# EAGLE design X2FA (EAGLE 9.7.0)
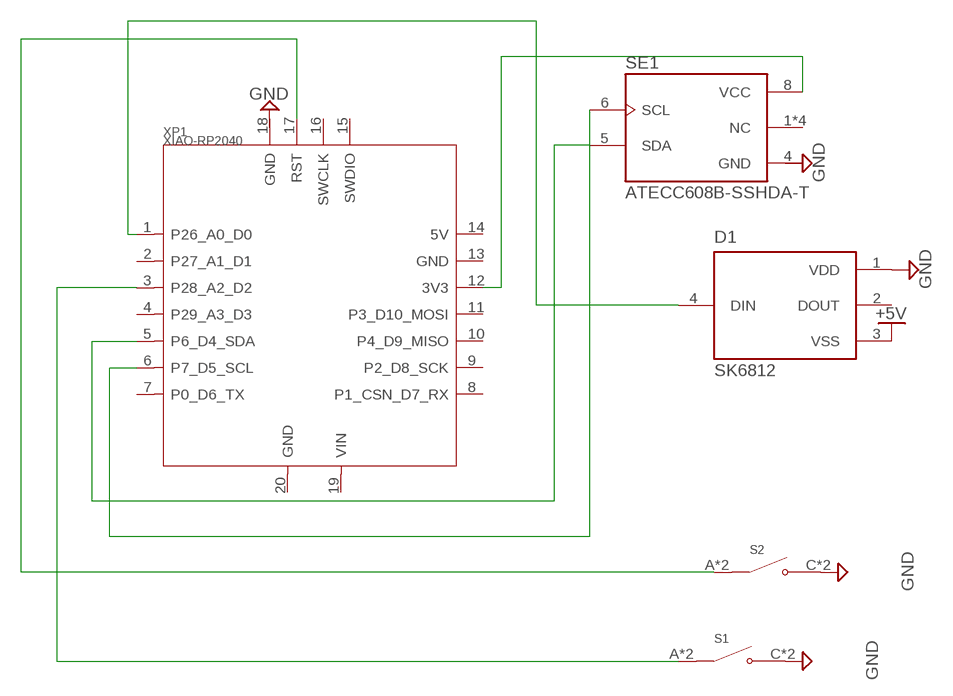
[diagram p0: schematic, sheet 1]

## Parts
D1  SK6812  [LED_SK6812]
S1  TS-1187A-B-A-B  [SW_TS-1187A-B-A-B]
S2  TS-1187A-B-A-B  [SW_TS-1187A-B-A-B]
SE1  ATECC608B-SSHDA-T  [SOIC127P600X175-8N]
XP1  XIAO-RP2040  [XIAO-SAMD21/RP2040-MODULE14P-2.54-21X17.8MM]

## Nets
+5V: D1.3(VSS)
GND: D1.1(VDD) S1.C(NO) S1.D(NO) S2.C(NO) S2.D(NO)
N$1: SE1.8(VCC) XP1.12(3V3)
N$2: D1.4(DIN) XP1.1(P26_A0_D0)
N$3: SE1.5(SDA) XP1.5(P6_D4_SDA)
N$4: SE1.6(SCL) XP1.6(P7_D5_SCL)
N$8: S2.A(COM) S2.B(COM) XP1.17(RST)
N$11: S1.A(COM) S1.B(COM) XP1.3(P28_A2_D2)
Unconnected: D1.2(DOUT) SE1.1(NC) SE1.2(NC) SE1.3(NC) SE1.7(NC) XP1.2(P27_A1_D1) XP1.4(P29_A3_D3) XP1.7(P0_D6_TX) XP1.8(P1_CSN_D7_RX) XP1.9(P2_D8_SCK) XP1.10(P4_D9_MISO) XP1.11(P3_D10_MOSI) XP1.13(GND) XP1.14(5V) XP1.15(SWDIO) XP1.16(SWCLK) XP1.18(GND) XP1.19(VIN) XP1.20(GND)

## Power pins joined to a net without a drawn wire
GND: SE1.4(GND)

## Library data of the parts
D1 = SK6812:SK6812: Check availability <https://pricing.snapeda.com/parts/SK6812/Normand%20Electronics/view-part?ref=eda>; AVAILABILITY: Not in stock; CHECK_PRICES: https://www.snapeda.com/parts/SK6812/Normand/view-part/?ref=eda; DESCRIPTION: 5.4x5.0x1.6 mm 0.2W Intelligent external control surface mount SMD LED (MSL:5a); MF: Normand Electronics; MP: SK6812; PACKAGE: None; PRICE: None; SNAPEDA_LINK: https://www.snapeda.com/parts/SK6812/Normand/view-part/?ref=snap
S1 S2 = TS-1187A-B-A-B:TS-1187A-B-A-B: Check availability <https://pricing.snapeda.com/parts/TS-1187A-B-A-B/XKB%20Industrial%20Precision/view-part?ref=eda>; AVAILABILITY: Not in stock; CHECK_PRICES: https://www.snapeda.com/parts/TS-1187A-B-A-B/XKB+Connection/view-part/?ref=eda; DESCRIPTION: TS-1187A-B-A-B XKB Connectivity; MF: XKB Industrial Precision; MP: TS-1187A-B-A-B; PACKAGE: Package; PRICE: None; SNAPEDA_LINK: https://www.snapeda.com/parts/TS-1187A-B-A-B/XKB+Connection/view-part/?ref=snap
SE1 = ATECC608B-SSHDA-T:ATECC608B-SSHDA-T; CHECK_PRICES: https://www.snapeda.com/parts/ATECC608B-SSHDA-T/Microchip/view-part/?ref=eda; DESCRIPTION: Security ICs / Authentication ICs ECC/ECDH, I2C, SOIC T/R; DIGIKEY_PART_NUMBER: 150-ATECC608B-SSHDA-TTR-ND; MF: Microchip Technology; MP: ATECC608B-SSHDA-T; PACKAGE: SO-8 Microchip; SNAPEDA_LINK: https://www.snapeda.com/parts/ATECC608B-SSHDA-T/Microchip/view-part/?ref=snap
XP1 = Seeed Studio XIAO Series:XIAO-RP2040: Seeed Studio XIAO RP2040 v1.22 - Raspberry Pi RP2040 Microcontroller - 32-bit 133MHz Dual-Core ARM® Cortex® M0+processor Seeed SKU: 102010428 Seeed Studio XIAO RP2040 is a microcontroller using the Raspberry Pi RP2040 chip. The MCU runs at up to 133MHz. It is built with rich interfaces in a tiny thumb size and fully supports Arduino, MicroPython, and CircuitPython. The onboard interfaces are enough for developing multiple applications. Buy now <https://www.seeedstudio.com/XIAO-RP2040-v1-0-p-5026.html> Wiki <https://wiki.seeedstudio.com/XIAO-RP2040/>

## Board
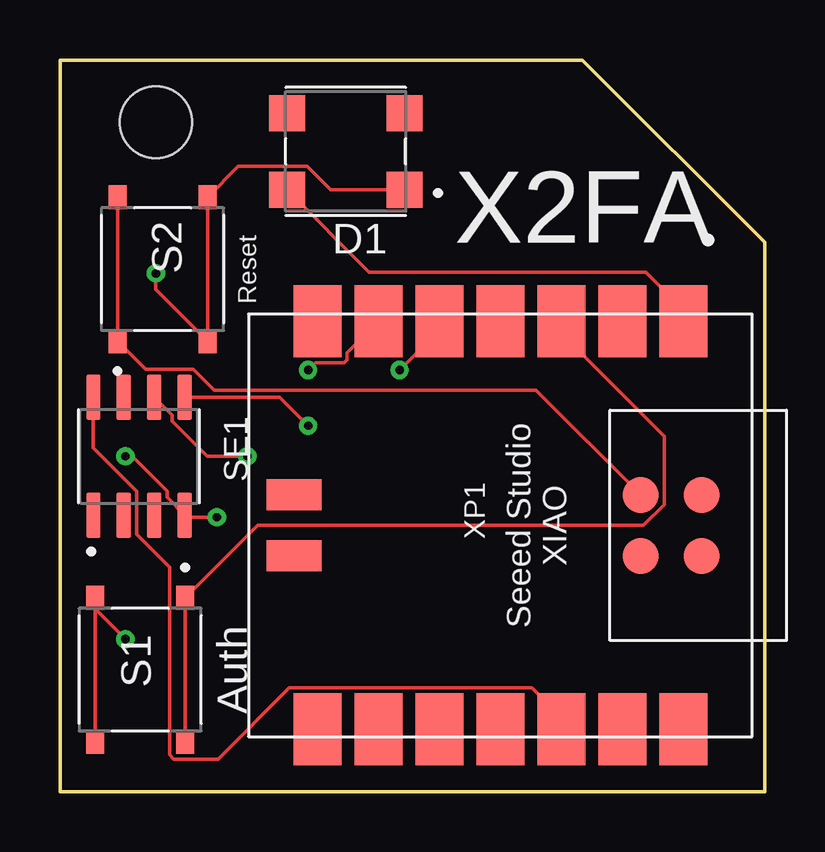
[diagram p1: board, top side]
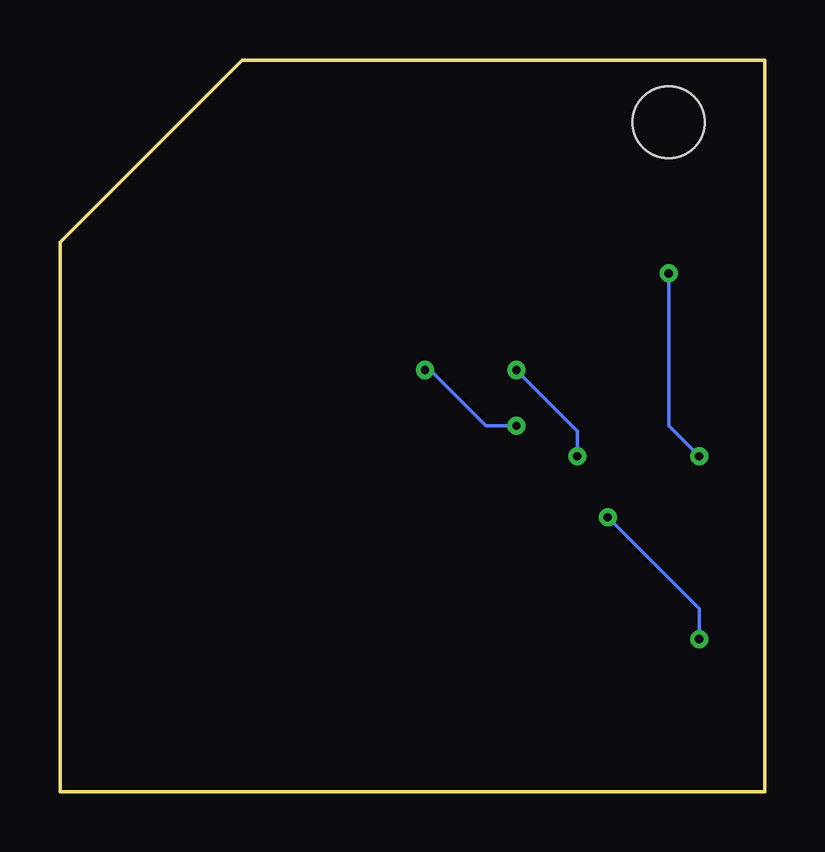
[diagram p2: board, bottom side, seen from below]

Size 29.38 x 30.48 mm. Coordinates in mm from the lower left corner, seen from the top.
Outline: 29.38,0 0,0 0,30.48 21.78,30.48 29.38,22.88 29.38,0
Copper layers (1*16): Top 0.035mm / dielectric 1.5mm / Bottom 0.035mm
Design rules "Fusion Electronics Design Rules": minimum track width 6mil, minimum drill 0.35mm, track to track 6mil, track to pad 6mil, pad to pad 6mil, via to via 6mil, smd to smd 6mil, copper to edge 40mil, drill to drill 6mil, minimum pad ring 10mil, minimum via ring 8mil, stop-mask expansion 4mil, vias tented up to drill 9999mil, thermal gap 10mil
Holes 3 mm at 4,27.89

### Footprints (pad centres in the part's own frame; a part is rotated, then mirrored left to right if it is on the bottom)
LED_SK6812 = smd 1.5 x 1.5: 1 -2.45,1.6; 2 -2.45,-1.6; 3 2.45,-1.6; 4 2.45,1.6
SW_TS-1187A-B-A-B = smd 1 x 0.75: A -3,1.875; B 3,1.875; C -3,-1.875; D 3,-1.875
SOIC127P600X175-8N = smd 1.9 x 0.6: 1 -2.455,1.905; 2 -2.455,0.635; 3 -2.455,-0.635; 4 -2.455,-1.905; 5 2.455,-1.905; 6 2.455,-0.635; 7 2.455,0.635; 8 2.455,1.905
XIAO-SAMD21/RP2040-MODULE14P-2.54-21X17.8MM = smd 3 x 2: 1 -8.5,7.62; 2 -8.5,5.08; 3 -8.5,2.54; 4 -8.5,0; 5 -8.5,-2.54; 6 -8.5,-5.08; 7 -8.5,-7.62; 8 8.5,-7.62; 9 8.5,-5.08; 10 8.5,-2.54; 11 8.5,0; 12 8.5,2.54; 13 8.5,5.08; 14 8.5,7.62 | smd 1.5 x 1.5: 15 -1.27,8.39; 16 1.27,8.39; 17 -1.27,5.85; 18 1.27,5.85 | smd 1.3 x 2.3: 19 -1.27,-8.6; 20 1.27,-8.6

### Placement (x,y rotation side)
D1  11.91,26.67 180 top
S1  3.34,5.08 270 top
S2  4.28,21.77 90 top
SE1  3.3,13.97 90 top
XP1  18.36,11.09 270 top

### Tracks (layer width: path | path; a pad name or v marks a point on that pad's centre or on a via)
GND  (via drill 0.35)
  Top 0.152: S1.C 1.47,7.61 | 1.47,7.61 S1.D | v4,21.59 4,20.92 S2.C S2.D 7.44,26.05 10.31,26.05 11.29,25.07 D1.1 | v2.73,13.97 3.01,13.97 4.46,12.52 4.46,12.26 SE1.4 5.29,11.43 v6.54,11.43 | v2.73,6.35 1.47,7.61
  Bottom 0.152: v4,21.59 4,15.24 v2.73,13.97 | v6.54,11.43 2.73,7.62 v2.73,6.35
N$1
  Top 0.152: XP1.12 20.9,3.09 19.67,4.32 9.56,4.32 6.59,1.35 4.75,1.35 4.57,1.53 4.57,9.35 3.19,10.73 3.19,12.52 1.39,14.31 SE1.8
N$2
  Top 0.152: XP1.1 25.98,20.09 24.43,21.64 12.89,21.64 D1.4
N$3  (via drill 0.35)
  Top 0.152: SE1.5 9.16,16.42 v10.35,15.24 | v14.16,17.56 15.43,18.83 15.43,19.2 XP1.5
  Bottom 0.152: v10.35,15.24 11.62,15.24 13.94,17.56 v14.16,17.56
N$4  (via drill 0.35)
  Top 0.152: SE1.6 4.67,15.68 4.67,15.42 6.13,13.97 v7.81,13.97 | v10.35,17.56 10.65,17.86 11.84,17.86 11.97,18 11.97,18.28 XP1.6
  Bottom 0.152: v7.81,13.97 7.81,15.02 v10.35,17.56
N$8
  Top 0.152: S2.B S2.A 3.56,17.6 5.55,17.6 6.43,16.73 19.85,16.73 XP1.17
N$11
  Top 0.152: S1.B S1.A 8.23,11.09 24.33,11.09 25.19,11.96 25.19,14.8 20.9,19.09 XP1.3

### Text on the board
tPlace: X2FA | Reset
tNames: Auth